# EAGLE design esp8285-miniboard-v1.0 (EAGLE 7.5.0)
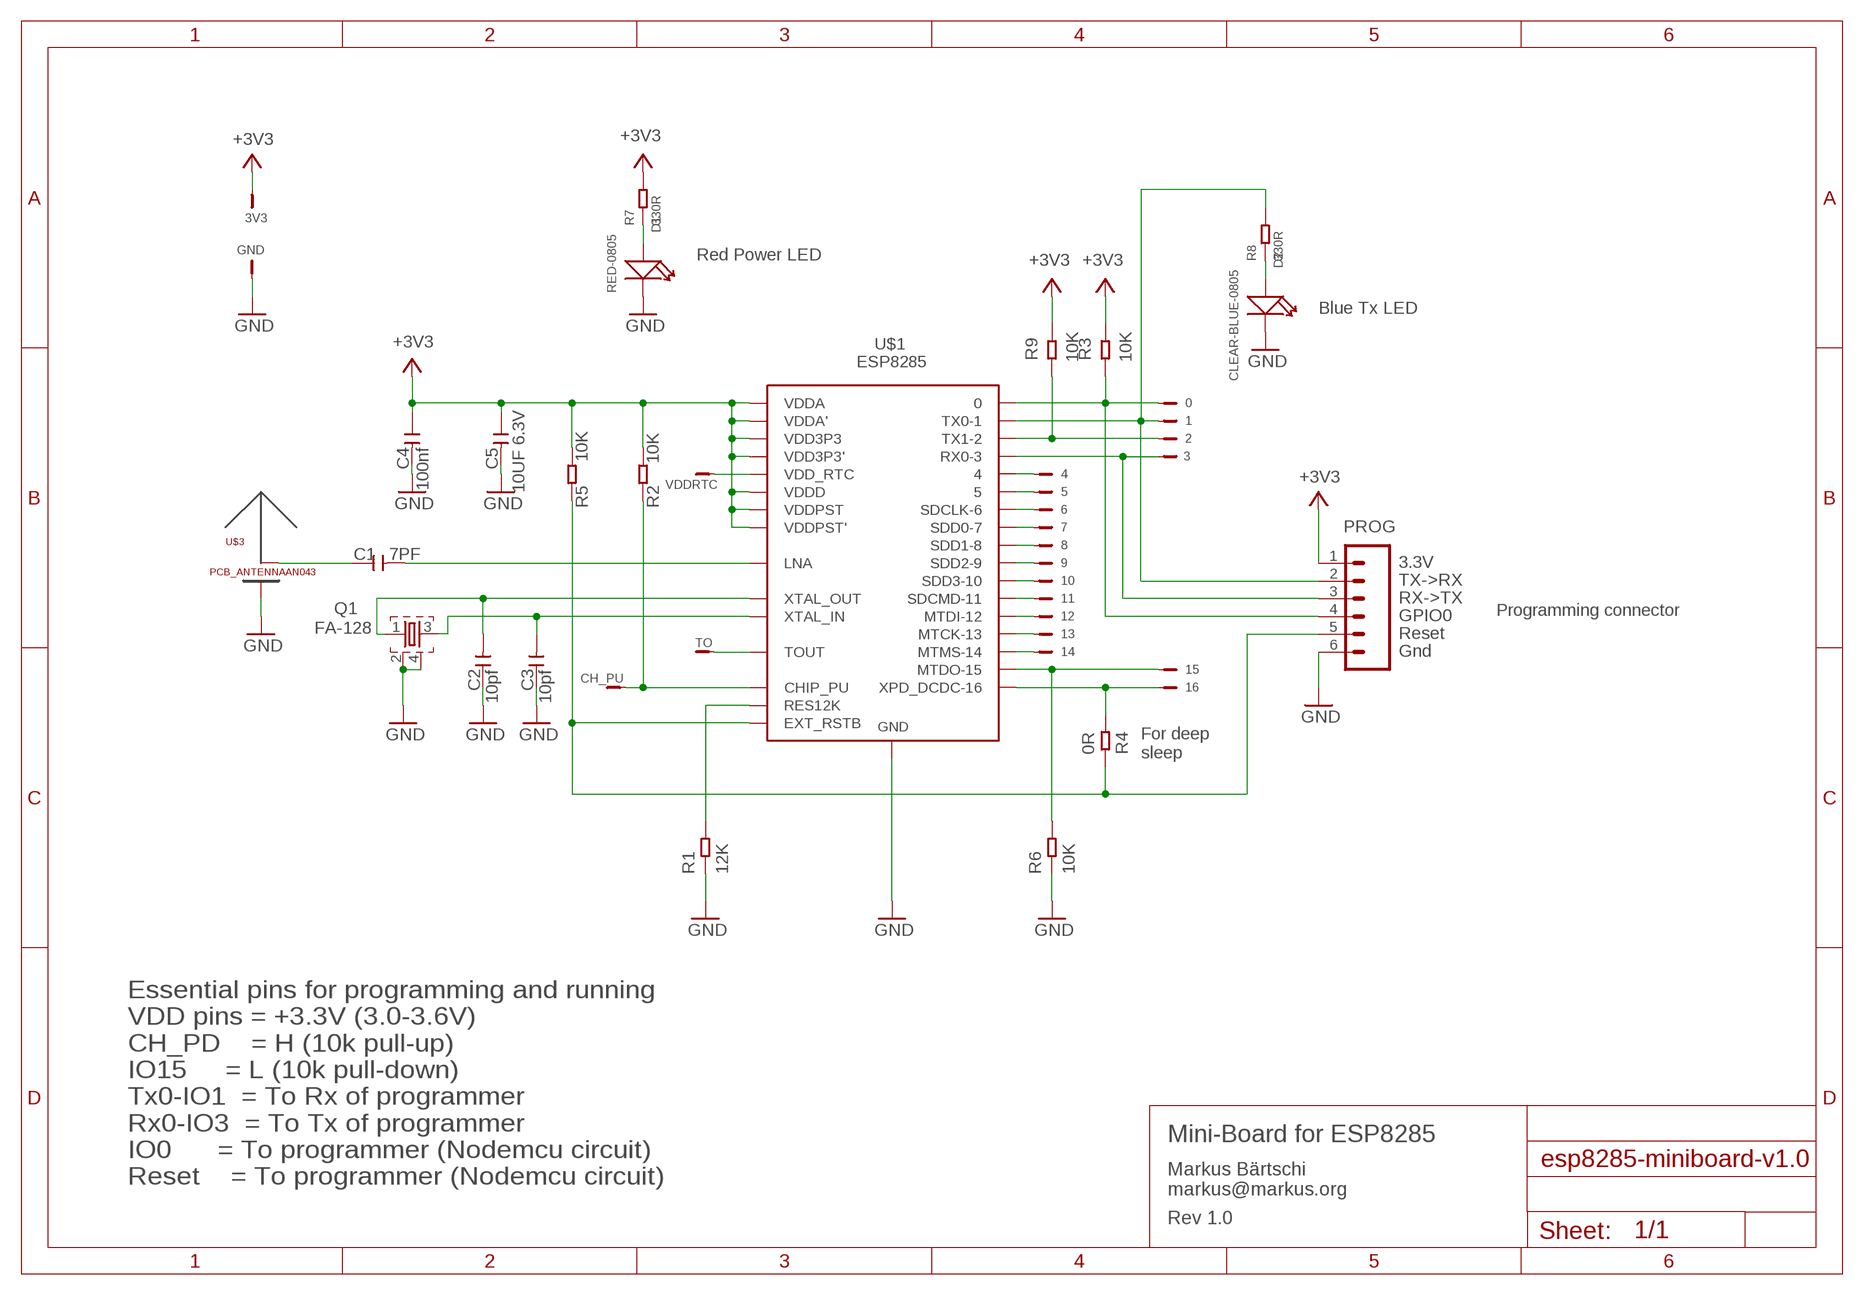
[diagram p0: schematic, sheet 1]

## Parts
0  TESTPIN-1X1-SM  [TESTPIN-HDR1X01]
1  TESTPIN-1X1-SM  [TESTPIN-HDR1X01]
2  TESTPIN-1X1-SM  [TESTPIN-HDR1X01]
3  TESTPIN-1X1-SM  [TESTPIN-HDR1X01]
3V3  TESTPIN-1X1-SM  [TESTPIN-HDR1X01]
4  TESTPIN-1X1-SM  [TESTPIN-HDR1X01]
5  TESTPIN-1X1-SM  [TESTPIN-HDR1X01]
6  TESTPIN-1X1-SM  [TESTPIN-HDR1X01]
7  TESTPIN-1X1-SM  [TESTPIN-HDR1X01]
8  TESTPIN-1X1-SM  [TESTPIN-HDR1X01]
9  TESTPIN-1X1-SM  [TESTPIN-HDR1X01]
10  TESTPIN-1X1-SM  [TESTPIN-HDR1X01]
11  TESTPIN-1X1-SM  [TESTPIN-HDR1X01]
12  TESTPIN-1X1-SM  [TESTPIN-HDR1X01]
13  TESTPIN-1X1-SM  [TESTPIN-HDR1X01]
14  TESTPIN-1X1-SM  [TESTPIN-HDR1X01]
15  TESTPIN-1X1-SM  [TESTPIN-HDR1X01]
16  TESTPIN-1X1-SM  [TESTPIN-HDR1X01]
C1  7PF  CERAMIC-7PF-50V-0.5PF-NPO(0603)  [C0603]
C2  10pf  CERAMIC-10PF-50V-5%-NPO(0603)  [C0603]
C3  10pf  CERAMIC-10PF-50V-5%-NPO(0603)  [C0603]
C4  100nf  CERAMIC-100NF-50V-10%-X7R(0603)  [C0603]
C5  10UF 6.3V  CERAMIC-10UF-6.3V-20%-X5R(0603)  [C0603]
CH_PU  TESTPIN-1X1-SM  [TESTPIN-HDR1X01]
D1  RED-0805  SMD-LED-CLEAR-RED(0805)  [LED-0805]
D2  CLEAR-BLUE-0805  SMD-LED-CLEAR-BLUE(0805)  [LED-0805]
GND  TESTPIN-1X1-SM  [TESTPIN-HDR1X01]
PROG  M06SIP  [1X06]
Q1  FA-128  [FA-128]
R1  12K  SMD-RES-12K-1%-1/10W(0603)  [R0603]
R2  10K  SMD-RES-10K-1%-1/10W(0603)  [R0603]
R3  10K  SMD-RES-10K-1%-1/10W(0603)  [R0603]
R4  0R  SMD-RES-0R-5%-1/10W(0603)  [R0603]
R5  10K  SMD-RES-10K-1%-1/10W(0603)  [R0603]
R6  10K  SMD-RES-10K-1%-1/10W(0603)  [R0603]
R7  330R  SMD-RES-330R-1%-1/10W(0603)  [R0603]
R8  330R  SMD-RES-330R-1%-1/10W(0603)  [R0603]
R9  10K  SMD-RES-10K-1%-1/10W(0603)  [R0603]
TO  TESTPIN-1X1-SM  [TESTPIN-HDR1X01]
U$1  ESP8285  [QFN-32]
U$3  PCB_ANTENNAAN043  [PCB_ANTENNA_TI-AN043]
VDDRTC  TESTPIN-1X1-SM  [TESTPIN-HDR1X01]

## Nets
+3V3: 3V3.1 C4.1 C5.1 PROG.1 R2.2 R3.2 R5.2 R7.2 R9.2 U$1.P$1(VDDA) U$1.P$3(VDD3P3) U$1.P$4(VDD3P3') U$1.P$11(VDDPST) U$1.P$17(VDDPST') U$1.P$29(VDDD) U$1.P$30(VDDA')
GND: C2.1 C3.1 C4.2 C5.2 D1.- D2.- GND.1 PROG.6 Q1.2 Q1.4 R1.1 R6.1 U$1.33-GND(GND) U$3.GND
N$1: D1.+ R7.1
N$2: C1.1 U$3.ANT(AND)
N$3: D2.+ R8.1
N$ANT: C1.2 U$1.P$2(LNA)
N$CHIP_PU: CH_PU.1 R2.1 U$1.P$7(CHIP_PU)
N$IO0: 0.1 PROG.4 R3.1 U$1.P$15
N$IO1: 1.1 PROG.2 R8.2 U$1.P$26(TX0-1)
N$IO2: 2.1 R9.1 U$1.P$14(TX1-2)
N$IO3: 3.1 PROG.3 U$1.P$25(RX0-3)
N$IO4: 4.1 U$1.P$16
N$IO5: 5.1 U$1.P$24
N$IO6: 6.1 U$1.P$21(SDCLK-6)
N$IO7: 7.1 U$1.P$22(SDD0-7)
N$IO8: 8.1 U$1.P$23(SDD1-8)
N$IO9: 9.1 U$1.P$18(SDD2-9)
N$IO10: 10.1 U$1.P$19(SDD3-10)
N$IO11: 11.1 U$1.P$20(SDCMD-11)
N$IO12: 12.1 U$1.P$10(MTDI-12)
N$IO13: 13.1 U$1.P$12(MTCK-13)
N$IO14: 14.1 U$1.P$9(MTMS-14)
N$IO15: 15.1 R6.2 U$1.P$13(MTDO-15)
N$IO16: 16.1 R4.1 U$1.P$8(XPD_DCDC-16)
N$RES12K: R1.2 U$1.P$31(RES12K)
N$RESET: PROG.5 R4.2 R5.1 U$1.P$32(EXT_RSTB)
N$TOUT: TO.1 U$1.P$6(TOUT)
N$VDDRTC: U$1.P$5(VDD_RTC) VDDRTC.1
N$XTAL-IN: C3.2 Q1.3 U$1.P$28(XTAL_IN)
N$XTAL-OUT: C2.2 Q1.1 U$1.P$27(XTAL_OUT)

## Notes on the sheet
- Red Power LED
- Blue Tx LED
- 3.3V
- TX->RX
- RX->TX
- Programming connector
- GPIO0
- Reset
- Gnd
- For deep
  sleep
- Mini-Board for ESP8285
- Essential pins for programming and running
  VDD pins = +3.3V (3.0-3.6V)
  CH_PD    = H (10k pull-up)
  IO15     = L (10k pull-down)
  Tx0-IO1  = To Rx of programmer
  Rx0-IO3  = To Tx of programmer
  IO0      = To programmer (Nodemcu circuit)
  Reset    = To programmer (Nodemcu circuit)
- Markus Bärtschi
  markus@markus.org
- Rev 1.0

## Library data of the parts
0 1-3 3V3 4-16 CH_PU GND TO VDDRTC = Markus:TESTPIN-1X1-SM: PIN HEADER
C1 = Seeed-OPL-Capacitor:CERAMIC-7PF-50V-0.5PF-NPO(0603): 302010114
C2 C3 = Seeed-OPL-Capacitor:CERAMIC-10PF-50V-5%-NPO(0603): 302010097
C4 = Seeed-OPL-Capacitor:CERAMIC-100NF-50V-10%-X7R(0603): 302010138; MPN: CC0603KRX7R9BB104
C5 = Seeed-OPL-Capacitor:CERAMIC-10UF-6.3V-20%-X5R(0603): 302010286; MPN: CC0603MRX5R5BB106
D1 = Seeed-OPL-Diode:SMD-LED-CLEAR-RED(0805): 304090046; MPN: 17-215SURC/S530-A2/TR8
D2 = Seeed-OPL-Diode:SMD-LED-CLEAR-BLUE(0805): 304090061; MPN: EL-17-215/BHC-AN1P2/3T
PROG = SparkFun:M06: Header 6 Standard 6-pin 0.1" header. Use with straight break away headers (SKU : PRT-00116), right angle break away headers (PRT-00553), swiss pins (PRT-00743), machine pins (PRT-00117), and female headers (PRT-00115). Molex polarized connector foot print use with SKU : PRT-08094 with associated crimp pins and housings. NOTES ON THE VARIANTS LOCK and LOCK_LONGPADS... This footprint was designed to help hold the alignment of a through-hole component (i.e. 6-pin header) while soldering it into place. You may notice that each hole has been shifted either up or down by 0.005 of an inch from it's more standard position (which is a perfectly straight line). This slight alteration caused the pins (the squares in the middle) to touch the edges of the holes. Because they are alternating, it causes a "brace" to hold the component in place. 0.005 has proven to be the perfect amount of "off-center" position when using our standard breakaway headers. Although looks a little odd when you look at the bare footprint, once you have a header in there, the alteration is very hard to notice. Also, if you push a header all the way into place, it is covered up entirely on the bottom side. This idea of altering the position of holes to aid alignment will be further integrated into the Sparkfun Library for other footprints. It can help hold any component with 3 or more connection pins.
Q1 = crystal:FA-: MHz RANGE CRYSTAL UNIT Source: Epson Toyocom
R1 = Seeed-OPL-Resistor:SMD-RES-12K-1%-1/10W(0603): 301010102; MPN: RC0603FR-0712KL
R2 R3 R5 R6 R9 = Seeed-OPL-Resistor:SMD-RES-10K-1%-1/10W(0603): 301010299; MPN: RC0603FR-0710KL
R4 = Seeed-OPL-Resistor:SMD-RES-0R-5%-1/10W(0603): 301010292; MPN: RC0603JR-070RL
R7 R8 = Seeed-OPL-Resistor:SMD-RES-330R-1%-1/10W(0603): 301010300; MPN: RC0603FR-07330RL
U$1 = Ma-ESP8285:ESP8285: ESP8285 Microcontroller with wifi and 1M flash by Espressif
U$3 = Ma-ESP8285:PCB_ANTENNA: PCB Antennas for Wifi Two models are provided, both from Texas Instruments design/application notes See also http://hackaday.com/2014/02/28/pcb-antenna-reference-designs/

## Board
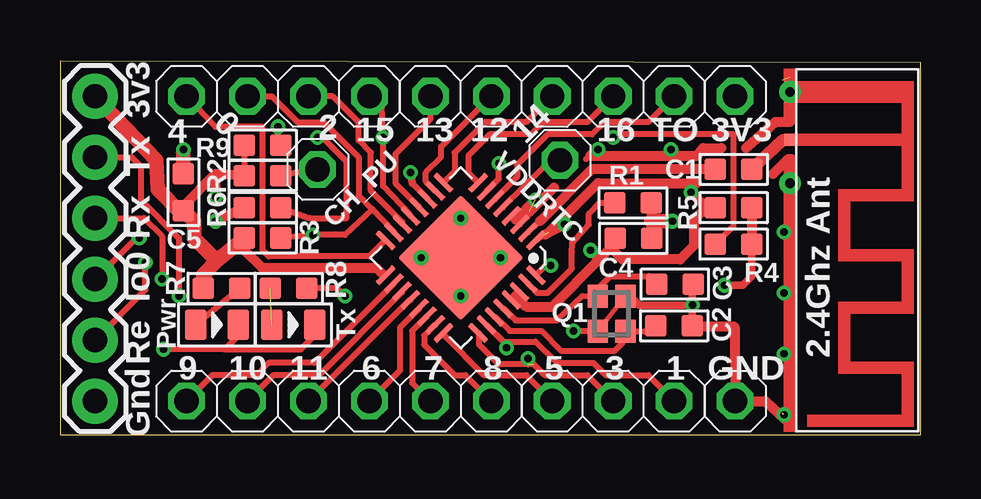
[diagram p1: board, top side]
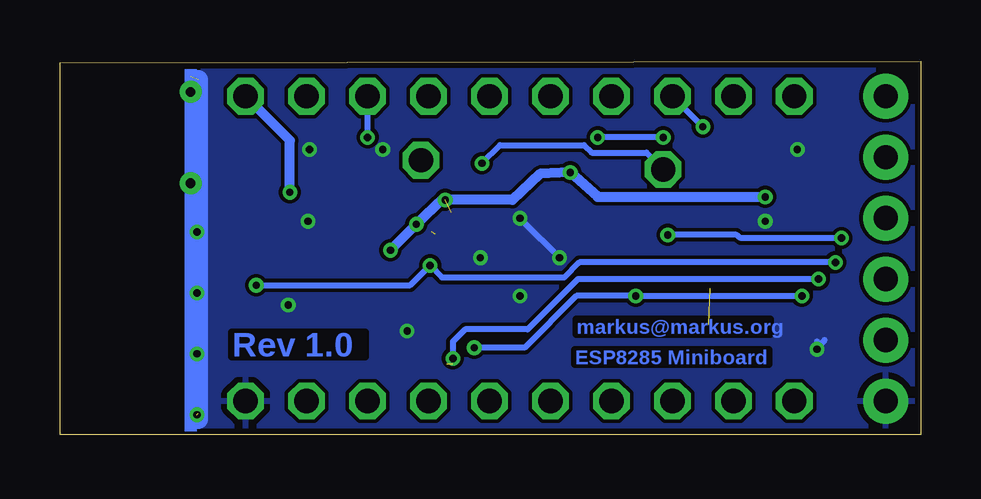
[diagram p2: board, bottom side, seen from below]

Size 35.87 x 15.55 mm. Coordinates in mm from the lower left corner, seen from the top.
Outline: 0,0 35.86,0 35.86,15.48 0,15.55 0,0
Copper layers (1*16): Top 0.035mm / dielectric 1.5mm / Bottom 0.035mm
Design rules "SeeedStudio_2layer_DRU_no_angle_20140221": minimum track width 6mil, minimum drill 12mil, track to track 6mil, track to pad 6mil, pad to pad 6mil, via to via 6mil, smd to smd 0mil, copper to edge 10mil, drill to drill 10mil, minimum pad ring 10mil, minimum via ring 6mil, stop-mask expansion 2mil, vias tented up to drill 100mil, thermal gap 10mil

### Footprints (pad centres in the part's own frame; a part is rotated, then mirrored left to right if it is on the bottom)
TESTPIN-HDR1X01 = drill 1.016 octagon: 1 0,0
C0603 = smd 0.889 x 0.889: 1 0,0.762; 2 0,-0.762
LED-0805 = smd 0.889 x 1.27: + -0.889,0; - 0.889,0
1X06 = drill 1.016 pad 1.88: 1 0,0; 2 2.54,0; 3 5.08,0; 4 7.62,0; 5 10.16,0; 6 12.7,0
FA-128 = smd 0.95 x 0.85: 1 -0.725,-0.575; 2 0.725,-0.575; 3 0.725,0.575; 4 -0.725,0.575
R0603 = smd 0.889 x 0.889: 1 0,0.762; 2 0,-0.762
QFN-32 = smd 3.7 x 3.7: 33-GND 0,0 | smd 0.25 x 1: P$1 1.7,2.725; P$2 1.225,2.725; P$3 0.75,2.725; P$4 0.25,2.725; P$5 -0.25,2.725; P$6 -0.725,2.725; P$7 -1.2,2.725; P$8 -1.7,2.725; P$17 -1.7,-2.725; P$18 -1.225,-2.725; P$19 -0.75,-2.725; P$20 -0.25,-2.725; P$21 0.25,-2.725; P$22 0.725,-2.725; P$23 1.225,-2.725; P$24 1.7,-2.725 | smd 1 x 0.25: P$9 -2.725,1.7; P$10 -2.725,1.225; P$11 -2.725,0.75; P$12 -2.725,0.25; P$13 -2.725,-0.25; P$14 -2.725,-0.725; P$15 -2.725,-1.225; P$16 -2.725,-1.7; P$25 2.725,-1.7; P$26 2.725,-1.225; P$27 2.725,-0.75; P$28 2.725,-0.25; P$29 2.725,0.25; P$30 2.725,0.725; P$31 2.725,1.225; P$32 2.725,1.7
PCB_ANTENNA_TI-AN043 = smd 0.5 x 0.5: ANT -3.9,-2.79 | smd 0.9 x 0.5: GND -5.9,-2.79 | drill 0.4: GND-PAD1 -5.9,-2.79; GND-PAD2 -2.09,-2.79

### Placement (x,y rotation side)
0  7.81,14.1 0 top
1  25.59,1.4 180 top
2  10.35,14.1 0 top
3  23.05,1.4 180 top
3V3  28.13,14.1 0 top
4  5.27,14.1 0 top
5  20.51,1.4 180 top
6  12.89,1.4 0 top
7  15.43,1.4 0 top
8  17.97,1.4 0 top
9  5.27,1.4 0 top
10  7.81,1.4 0 top
11  10.35,1.4 0 top
12  17.97,14.1 180 top
13  15.43,14.1 180 top
14  20.51,14.1 180 top
15  12.89,14.1 0 top
16  23.05,14.1 180 top
C1  28.07,11.05 270 top
C2  25.59,4.53 270 top
C3  25.62,6.27 270 top
C4  23.89,8.17 90 top
C5  5.14,10.1 180 top
CH_PU  10.73,11.05 0 top
D1  6.54,4.57 0 top
D2  9.72,4.57 0 top
GND  28.13,1.4 0 top
PROG  1.46,14.1 270 top
Q1  22.98,5.04 90 top
R1  23.88,9.65 270 top
R2  8.45,10.79 270 top
R3  8.45,8.19 270 top
R4  28.07,7.94 90 top
R5  28.07,9.46 270 top
R6  8.45,9.46 90 top
R7  6.73,6.1 270 top
R8  9.53,6.1 90 top
R9  8.45,12.07 270 top
TO  25.59,14.1 180 top
U$1  16.7,7.37 315 top
U$3  33.21,8.38 270 top
VDDRTC  20.83,11.43 0 top

### Tracks (layer width: path | path; a pad name or v marks a point on that pad's centre or on a via)
+3V3  (via drill 0.3)  (2 unrouted)
  Top 0.254: U$1.P$29 U$1.P$30 19.14,5.93 18.99,5.78 | 14.67,10.48 15.3,9.84 U$1.P$11 | U$1.P$4 U$1.P$3 19,8.92 arc-45 18.99,8.95 | U$1.P$1 20.22,8.34 | U$1.P$17 13.44,6.64 13.4,6.73 | R9.2 R2.2
  Top 0.305: 14.67,10.48 v14.6,10.92
  Top 0.406: 18.99,5.78 19.43,5.33 20.51,5.33 22.48,7.3 | 18.99,8.95 v19.81,9.78 | 22.48,7.3 22.96,7.78 | 22.96,7.78 23.07,7.89 arc-45 C4.1 | 26.92,9.46 26.42,8.95 26.42,7.87 25.84,7.3 23.43,7.3 22.96,7.78 | R5.2 26.92,9.46 | 26.92,9.46 v26.29,10.1 | R2.2 6.48,10.86 | 6.48,10.86 5.08,9.46 5.08,9.4 C5.1 | 20.22,8.34 v21.02,8.76 | v22.1,7.68 22.48,7.3 | 13.4,6.73 13.21,6.92 8.45,6.92 7.68,7.68 R3.2 | 6.48,10.86 v6.48,9.91 | 19.56,9.27 20.57,10.29 | 20.38,8.45 22.42,10.48 26.54,10.48
  Top 0.61: R7.2 5.97,6.67 6.54,7.24 | 6.54,7.24 R3.2 | 6.54,7.24 5.59,8.19 5.59,8.89 C5.1 | 5.08,9.46 5.08,9.21 4.06,10.22 4,11.43 PROG.1
  Bottom 0.406: v26.29,10.1 26.29,12.26 3V3.1 | v22.1,7.68 v21.02,8.76 19.88,9.84 v19.81,9.78 17.02,9.78 15.87,10.86 v14.6,10.92 13.46,9.91 v6.48,9.91
GND  (via drill 0.3)  (2 unrouted)
  Top 0.203: Q1.4 Q1.2
  Top 0.254: v16.7,5.78 U$1.33-GND v16.7,9.02 | v15.05,7.37 15.3,7.11 | v18.35,7.37 18.1,7.37 17.46,8 | Q1.4 21.6,4.31 v21.4,4.32 | R1.1 24.64,8.89 | 6.86,3.56 10.03,3.56 10.48,4 10.48,4.44 D2.- | D1.- 7.43,4.13 6.86,3.56 | 6.86,3.56 v4.32,3.56 | 21.91,11.49 22.1,11.62 22.16,11.62 v22.42,11.87 | U$3.GND 30.42,14.92
  Top 0.305: Q1.2 23.77,5.76 24.13,5.4 v26.35,5.4 | C2.1 | C3.1 26.35,6.24 v26.35,5.4 | C2.1 v26.35,5.4
  Top 0.406: C4.2 24.66,9.42 arc45 R1.1 | C2.1 26.39,4.49 28.11,4.49 GND.1 29.4,1.4 30.48,0.38 30.48,11.49 30.35,11.49 29.72,10.86 | R6.1 v6.48,8.89 | 22.1,11.62 26.54,11.62 26.8,11.94 27.56,11.94 | 30.42,14.92 30.42,13.02 29.78,13.02 28.64,12 28.58,11.94
  Top 0.61: 24.64,8.89 v25.53,8.89 | C5.2 v5.14,11.87
  Bottom 0.254: v16.7,5.78 16.7,5.72 16.76,5.72 | v16.7,9.02 16.7,8.89 16.57,8.89 v15.05,7.37 | v21.4,4.32 21.46,4.32 | v4.32,3.56 4.32,3.81 | 4.32,3.87 4.32,3.81 | 4.32,3.81 4.13,3.81 4,3.94 | 30.1,0.64 30.1,0.89 30.42,1.21
  Bottom 0.305: v26.35,5.4 26.42,5.4
  Bottom 0.813: 30.1,14.8 30.1,0.64
  other vias: 25.46,11.87 30.16,8.45 30.16,5.91 30.16,3.37 30.16,0.83
  pour Bottom: 0.13,15.37 30.48,15.37 30.42,0.13 0.06,0.13
N$1
  Top 0.254: D1.+ R7.1
N$2
  Top 0.406: C1.1 28.87,11.11
  Top 0.508: 28.87,11.11 30.1,12.26 30.13,12.28 U$3.ANT
N$3  (1 unrouted)
N$ANT
  Top 0.254: 20,8.89 arc45 19.92,8.86 U$1.P$2
  Top 0.406: C1.2 22.16,11.05 20,8.89
N$CHIP_PU  (via drill 0.3)
  Top 0.254: U$1.P$7 17.78,10.16 18.29,10.67 v18.29,11.3 | R2.1 9.97,10.92 10.6,10.92 CH_PU.1
  Bottom 0.254: v18.29,11.3 17.53,12.07 14.03,12.07 13.72,11.75 11.43,11.75 CH_PU.1
N$IO0  (via drill 0.3)
  Top 0.254: U$1.P$15 13.91,8.44 13.02,9.4 | 13.02,9.4 11.87,8.32 v10.54,8.32 R3.1 | 0.1 8.83,14.1 9.91,13.02 10.99,13.02 12.45,11.56 12.45,9.97 13.02,9.4 | v3.3,8.19 3.18,8.19 PROG.4
  Bottom 0.254: v3.3,8.19 7.49,8.19 7.68,8.32 v10.54,8.32
N$IO1  (via drill 0.3)
  Top 0.254: 1.1 24.51,2.48 22.73,2.48 22.22,2.98 20.7,2.98 19.81,3.87 18.46,3.87 U$1.P$26 18.54,3.81 18.61,3.75 v18.61,3.62 | v11.87,5.78 11.56,6.1 R8.2 | PROG.2 2.98,11.56 3.37,11.18 3.37,9.78 4.95,8.19 v4.95,5.78
  Bottom 0.254: v18.61,3.62 16.51,3.62 14.35,5.78 v11.87,5.78 v4.95,5.78
N$IO2  (via drill 0.3)
  Top 0.254: U$1.P$14 14.26,8.85 12.95,10.16 12.95,11.75 12.45,12.26 12.45,13.02 11.37,14.1 2.1 | R9.1 9.08,12.07 v9.08,12.83
  Bottom 0.254: v9.08,12.83 2.1
N$IO3  (via drill 0.3)  (1 unrouted)
  Top 0.254: 3.1 21.97,2.48 20.19,2.48 19.75,2.92 18.29,2.92 17.46,3.75 17.46,4.2 U$1.P$25 | v19.49,3.18 19.49,2.92 | PROG.3 3.49,9.02 4.25,8.26 v4.25,6.48
  Bottom 0.254: v4.25,6.48 14.29,6.48 16.38,4.38 18.99,4.38 19.49,3.87 v19.49,3.18
N$IO4
  Top 0.254: U$1.P$16 13.55,8.09 12.89,7.43 8.7,7.43 8.45,7.68 8.45,12.83 6.48,12.83 4.1
N$IO5
  Top 0.254: 5.1 19.43,2.48 17.65,2.48 16,4.15 U$1.P$24
N$IO6
  Top 0.254: U$1.P$21 14.95,5.23 14.16,4.44 14.16,2.67 6.1
N$IO7
  Top 0.254: 7.1 14.67,2.16 14.67,4.32 U$1.P$22
N$IO8
  Top 0.254: 8.1 16.89,2.48 16.45,2.48 15.18,3.75 15.18,4.13 15.62,4.57 U$1.P$23
N$IO9
  Top 0.254: 9.1 6.35,2.48 8.19,2.48 8.7,2.98 10.6,2.98 13.91,6.29 U$1.P$18
N$IO10
  Top 0.254: U$1.P$19 14.24,5.92 10.79,2.48 8.89,2.48 10.1
N$IO11
  Top 0.254: U$1.P$20 14.57,5.62 11.1
N$IO12
  Top 0.254: 12.1 15.87,12 15.87,11.56 15.24,10.92 15.24,10.54 15.62,10.16 U$1.P$10
N$IO13
  Top 0.254: U$1.P$12 14.95,9.5 13.97,10.48 13.97,11.68 15.43,13.14 13.1
N$IO14
  Top 0.254: 14.1 19.43,13.02 17.72,13.02 16.45,11.75 16.45,10.97 U$1.P$9
N$IO15  (via drill 0.3)
  Top 0.254: U$1.P$13 14.57,9.18 13.46,10.35 v13.46,12.38 13.4,13.65 15.1 | R6.2 10.41,9.02 11.94,9.02 11.94,11.37 10.92,12.38 v10.73,12.38
  Bottom 0.254: v10.73,12.38 v13.46,12.38
N$IO16  (via drill 0.3)
  Top 0.254: 16.1 21.97,13.02 20.13,13.02 19.62,12.51 17.91,12.51 17.02,11.62 17.02,10.9 U$1.P$8 | R4.1 28.07,8.7 28.07,12.51 23.05,12.51 v23.05,12.38
  Bottom 0.254: v23.05,12.38 16.1
N$RES12K
  Top 0.254: U$1.P$31 19.49,6.29 19.88,5.91 20.32,5.91 21.33,6.91 21.33,7.61 21.34,7.94 21.34,8 22.03,8.76 22.03,9.21 22.48,9.65 R1.2
N$RESET  (via drill 0.3)
  Top 0.254: v20.45,7.05 20.24,7.05 U$1.P$32 | PROG.5 3.56,6.03 v3.56,7.18
  Top 0.305: R4.2 28.83,6.6 28.45,6.22 v27.69,6.22
  Top 0.406: R5.1 R4.2
  Bottom 0.254: v27.69,6.22 21.27,6.22 v20.45,7.05 19.94,6.54 14.86,6.54 14.22,7.18 v3.56,7.18
N$TOUT
  Top 0.254: TO.1 24.51,13.02 22.67,13.02 22.16,12.51 20.32,12.51 19.05,11.24 19.05,10.74 U$1.P$6
N$VDDRTC
  Top 0.254: U$1.P$5 20.19,11.18 20.37,11.36 arc-45 20.55,11.43 VDDRTC.1
N$XTAL-IN
  Top 0.254: U$1.P$28 18.49,5.26 18.99,4.76 20.7,4.76 21.78,5.78 Q1.3 22.4,6.08 22.92,6.6 24.52,6.6 C3.2
N$XTAL-OUT
  Top 0.254: U$1.P$27 18.14,4.91 18.73,4.32 20.07,4.32 20.89,3.49 23.11,3.49 23.43,3.81 23.43,4.19 Q1.1 24.42,4.31 C2.2

### Text on the board
Bottom: markus@markus.org | ESP8285 Miniboard | Rev 1.0
tNames: 3v3 | Tx | Rx | Io0 | Re | Tx | Pwr | Gnd